# EAGLE design v1 (EAGLE 7.7.0)
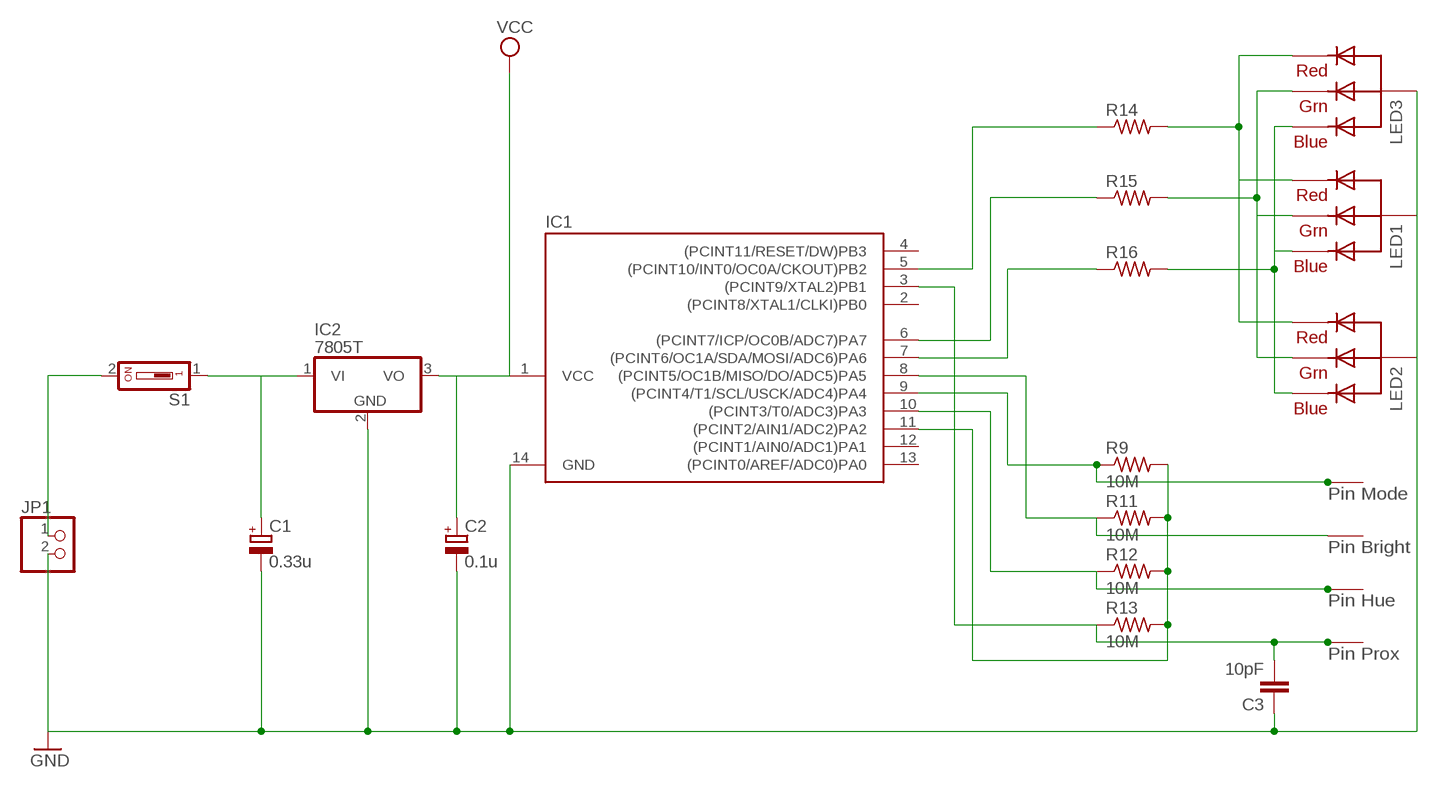
[diagram p0: schematic, sheet 1]

## Parts
2  TOUCH  [RENG]
C1  0.33u  CPOL-EUE2.5-6  [E2,5-6]
C2  0.1u  CPOL-EUE2.5-6  [E2,5-6]
C3  10pF  0.1UF-KIT-EZ-50V-20%  [CAP-PTH-SMALL-KIT]
IC1  TINY24/44/84-PU  [DIL14]
IC2  7805T  [TO220H]
JP1  PINHD-1X2/90  [1X02/90]
LED1  RGBLED_CA-5MM  [LED5MMRGB]
LED2  RGBLED_CA-5MM  [LED5MMRGB]
LED3  RGBLED_CA-5MM  [LED5MMRGB]
PIN_PROX  TOUCH  [RENG]
PROX_PIN  TOUCH  [RENG]
R9  10M  R-US_0207/10  [0207/10]
R11  10M  R-US_0207/10  [0207/10]
R12  10M  R-US_0207/10  [0207/10]
R13  10M  R-US_0207/10  [0207/10]
R14  R-US_0207/10  [0207/10]
R15  R-US_0207/10  [0207/10]
R16  R-US_0207/10  [0207/10]
S1  SD4-01  [SD4-01]
U$3  TOUCH  [RENG]

## Nets
B: LED1.4(BLUE) LED2.4(BLUE) LED3.4(BLUE) R16.2
B1: IC1.7((PCINT6/OC1A/SDA/MOSI/ADC6)PA6) R16.1
BASE: IC1.11((PCINT2/AIN1/ADC2)PA2) R9.2 R11.2 R12.2 R13.2
G: LED1.3(GREEN) LED2.3(GREEN) LED3.3(GREEN) R15.2
G1: IC1.6((PCINT7/ICP/OC0B/ADC7)PA7) R15.1
GND: C1.- C2.- C3.1 IC1.14(GND) IC2.2(GND) JP1.2 LED1.2(VCC) LED2.2(VCC) LED3.2(VCC)
N$2: JP1.1 S1.2
N$5: C1.+ IC2.1(VI) S1.1
PIN0: 2.T IC1.8((PCINT5/OC1B/MISO/DO/ADC5)PA5) R11.1
PIN1: IC1.9((PCINT4/T1/SCL/USCK/ADC4)PA4) PIN_PROX.T R9.1
PIN2: IC1.10((PCINT3/T0/ADC3)PA3) R12.1 U$3.T
PIN3: C3.2 IC1.3((PCINT9/XTAL2)PB1) PROX_PIN.T R13.1
R: LED1.1(RED) LED2.1(RED) LED3.1(RED) R14.2
R1: IC1.5((PCINT10/INT0/OC0A/CKOUT)PB2) R14.1
VCC: C2.+ IC1.1(VCC) IC2.3(VO)
Unconnected: IC1.2((PCINT8/XTAL1/CLKI)PB0) IC1.4((PCINT11/RESET/DW)PB3) IC1.12((PCINT1/AIN0/ADC1)PA1) IC1.13((PCINT0/AREF/ADC0)PA0)

## Notes on the sheet
- Pin Mode
- Pin Bright
- Pin Hue
- Pin Prox

## Library data of the parts
2 PIN_PROX PROX_PIN U$3 = madebyreng:TOUCH
C1 C2 = rcl:CPOL-EU: POLARIZED CAPACITOR, European symbol
C3 = SparkFun-Capacitors:0.1UF: 0.1µF ceramic capacitors A capacitor is a passive two-terminal electrical component used to store electrical energy temporarily in an electric field.; PROD_ID: CAP-08370; VALUE: 0.1uF
IC1 = atmega-atxmega:TINY24/44/84: • High Performance, Low Power AVR® 8-bit Microcontroller • Advanced RISC Architecture – 120 Powerful Instructions – Most Single Clock Cycle Execution – 32 x 8 General Purpose Working Registers – Fully Static Operation • High Endurance, Non-volatile Memory Segments – 2K/4K/8K Bytes of In-System, Self-programmable Flash Program Memory • Endurance: 10,000 Write/Erase Cycles – 128/256/512 Bytes of In-System Programmable EEPROM • Endurance: 100,000 Write/Erase Cycles – 128/256/512 Bytes of Internal SRAM – Data Retention: 20 years at 85°C / 100 years at 25°C – Programming Lock for Self-programming Flash & EEPROM Data Security • Peripheral Features – One 8-bit and One 16-bit Timer/Counter with Two PWM Channels, Each – 10-bit ADC • 8 Single-ended Channels • 12 Differential ADC Channel Pairs with Programmable Gain (1x / 20x) – Programmable Watchdog Timer with Separate On-chip Oscillator – On-chip Analog Comparator – Universal Serial Interface • Special Microcontroller Features – debugWIRE On-chip Debug System – In-System Programmable via SPI Port – Internal and External Interrupt Sources • Pin Change Interrupt on 12 Pins – Low Power Idle, ADC Noise Reduction, Standby and Power-down Modes – Enhanced Power-on Reset Circuit – Programmable Brown-out Detection Circuit with Software Disable Function – Internal Calibrated Oscillator – On-chip Temperature Sensor • I/O and Packages – Available in 20-pin QFN/MLF/VQFN, 14-pin SOIC, 14-pin PDIP and 15-ball UFBGA – Twelve Programmable I/O Lines • Operating Voltage: – 1.8 – 5.5V • Speed Grade: – 0 – 4 MHz @ 1.8 – 5.5V – 0 – 10 MHz @ 2.7 – 5.5V – 0 – 20 MHz @ 4.5 – 5.5V • Industrial Temperature Range: -40°C to +85°C • Low Power Consumption – Active Mode: • 210 μA at 1.8V and 1 MHz – Idle Mode: • 33 μA at 1.8V and 1 MHz – Power-down Mode: • 0.1 μA at 1.8V and 25°C
IC2 = linear:78*: Positive VOLTAGE REGULATOR Source: http://cache.national.com/ds/LM/LM78L05.pdf http://www.fairchildsemi.com/ds/LM/LM7805.pdf
JP1 = pinhead:PINHD-1X2: PIN HEADER
LED1-LED3 = adafruit:RGBLED_CA: RGB LED, common-anode 5MM Staggered pins 5mm Piranha package http://www.ladyada.net/library/pcb/eaglelibrary.html
R9 R11-R16 = rcl:R-US_: RESISTOR, American symbol
S1 = switch-dil:SD4-01: DIL/CODE SWITCH; OC_FARNELL: unknown; OC_NEWARK: unknown

## Board
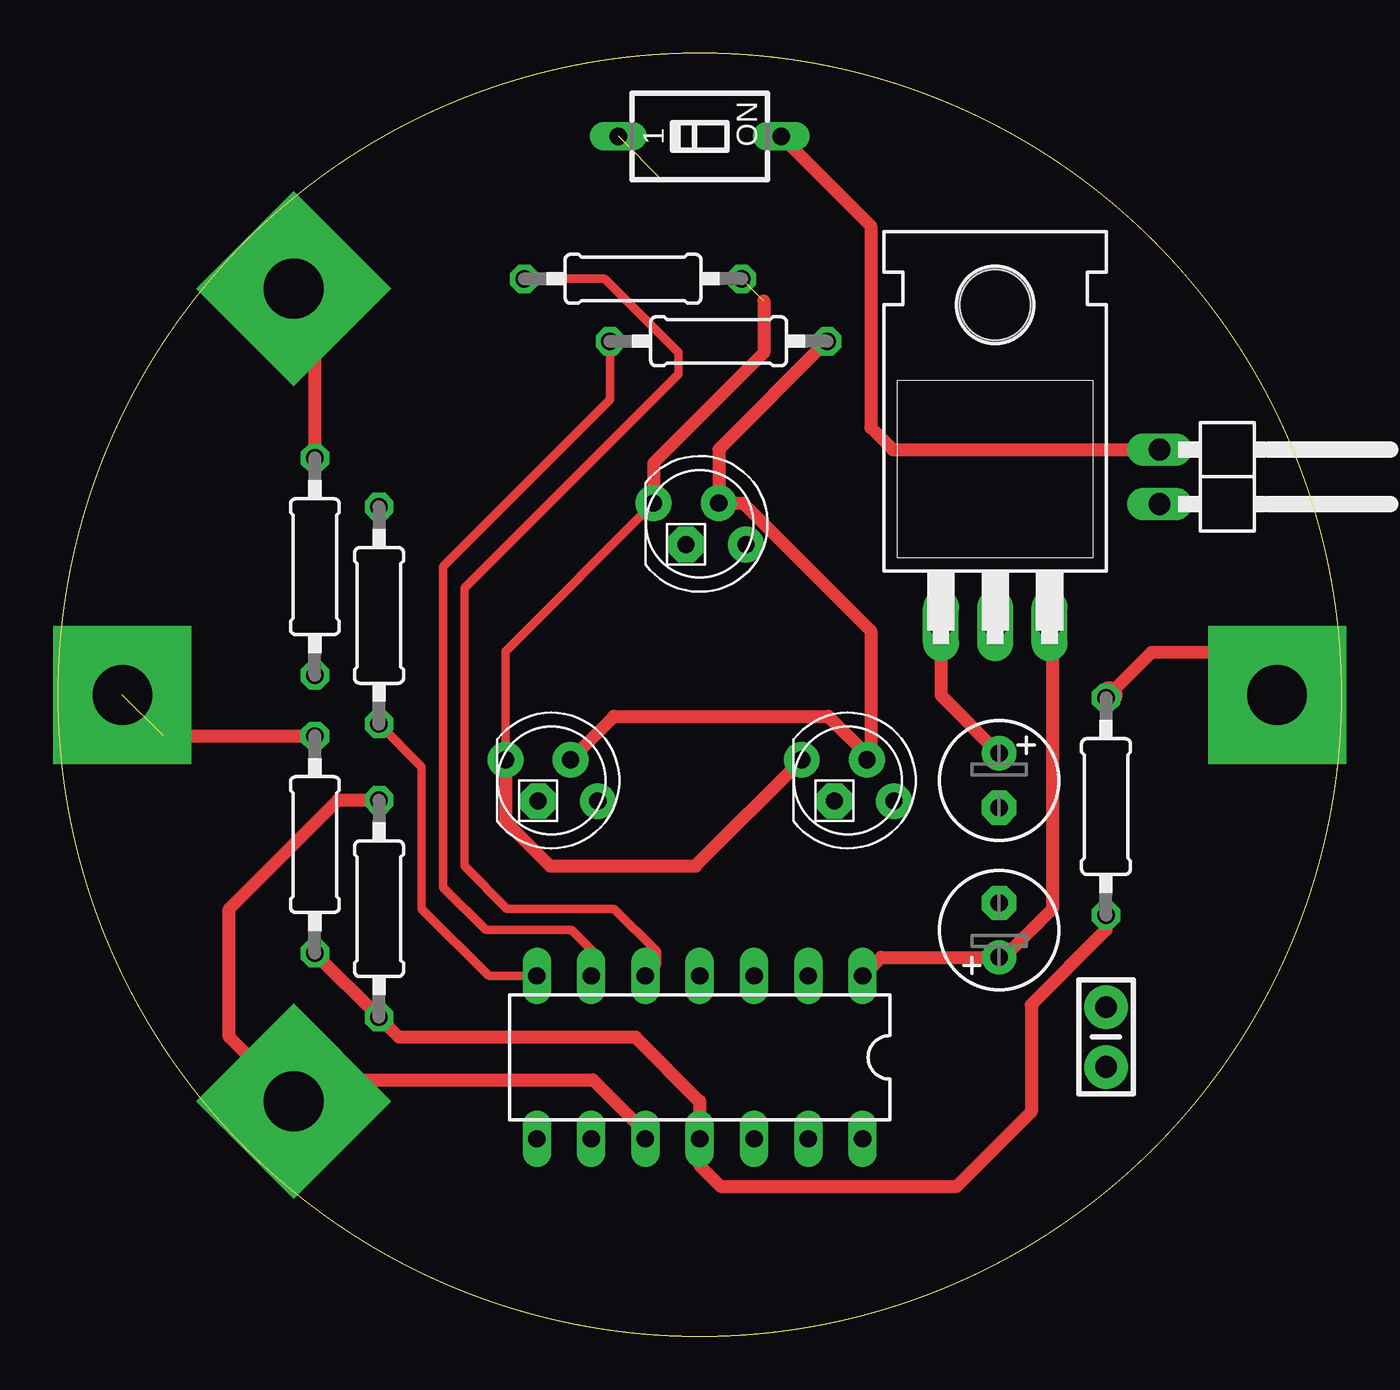
[diagram p1: board, top side]
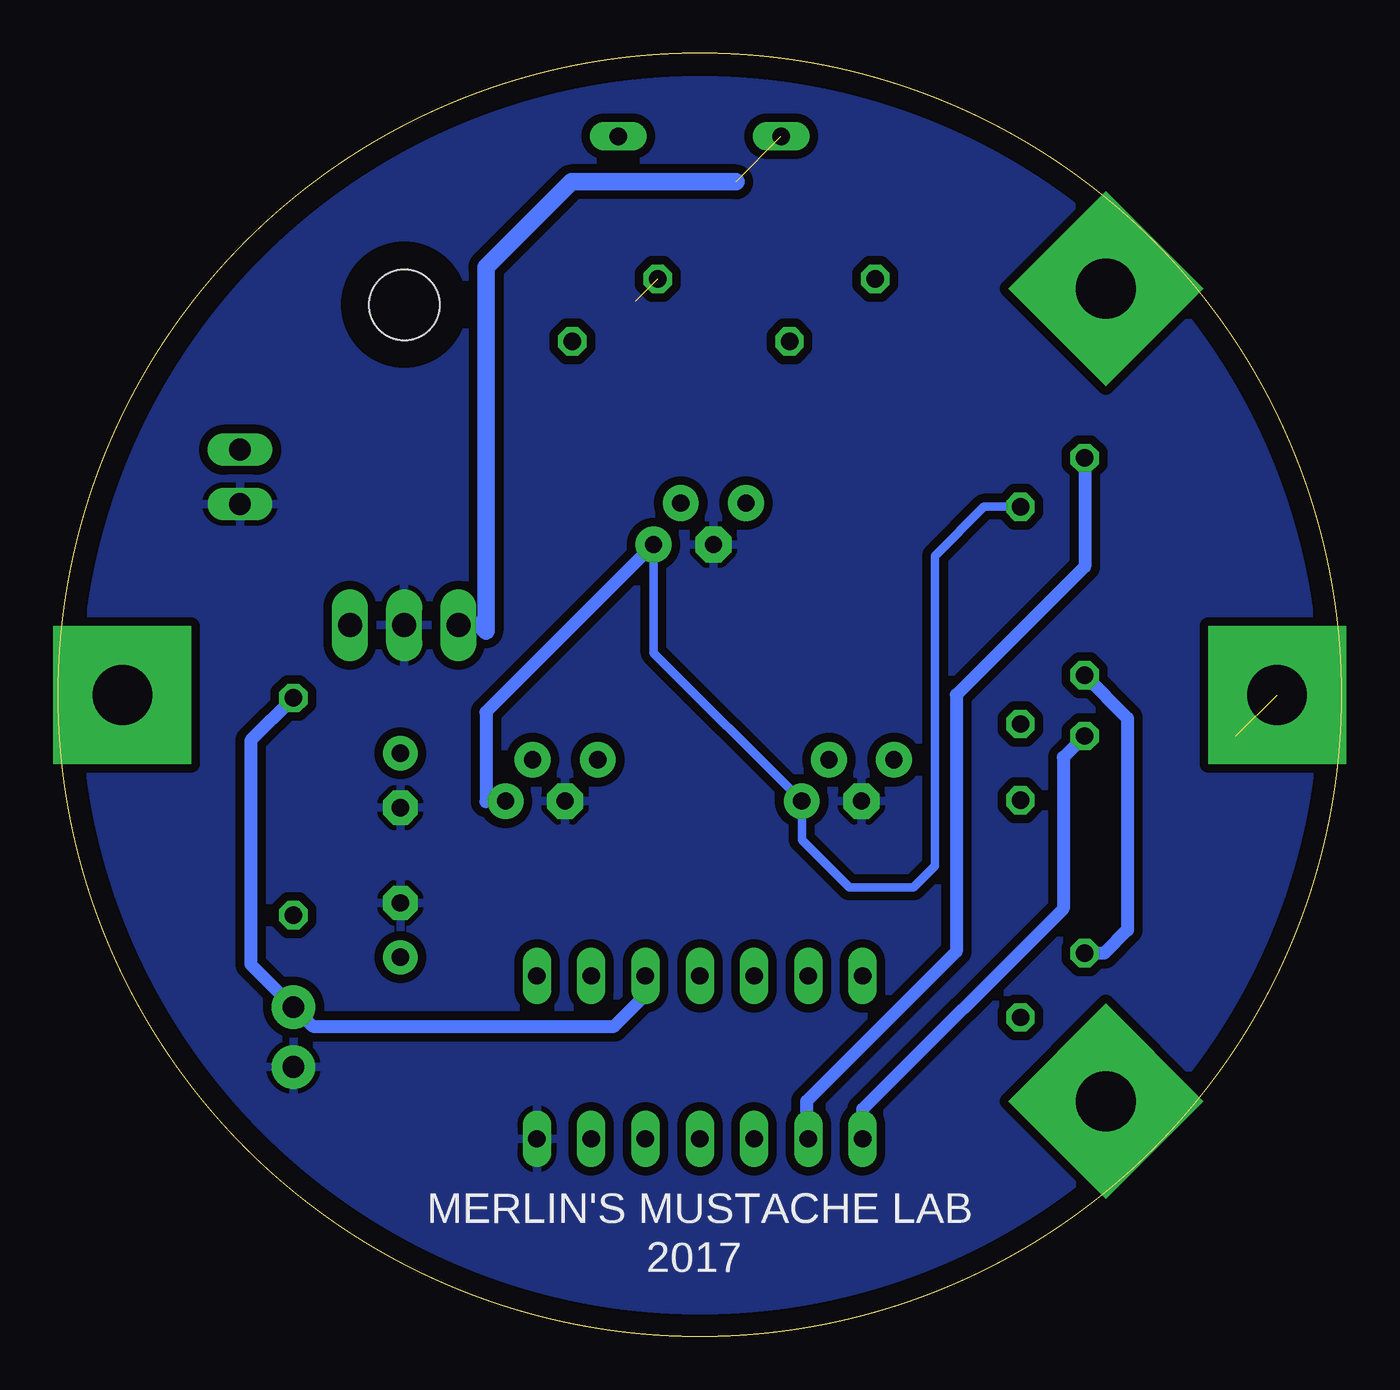
[diagram p2: board, bottom side, seen from below]

Size 60 x 60 mm. Coordinates in mm from the lower left corner, seen from the top.
Outline: circle at 30,30 radius 30
Copper layers (1*16): Top 0.035mm / dielectric 1.5mm / Bottom 0.035mm
Design rules "default": minimum track width 10mil, minimum drill 24mil, track to track 8mil, track to pad 8mil, pad to pad 8mil, via to via 8mil, smd to smd 8mil, copper to edge 40mil, drill to drill 8mil, minimum pad ring 10mil, minimum via ring 8mil, stop-mask expansion 4mil, vias tented up to drill 0mil, thermal gap 10mil

### Footprints (pad centres in the part's own frame; a part is rotated, then mirrored left to right if it is on the bottom)
RENG = drill 2.8 pad 6.452 square: T 0,0
E2,5-6 = drill 0.813 pad 1.6: + -1.27,0 | drill 0.813 pad 1.6 octagon: - 1.27,0
CAP-PTH-SMALL-KIT = drill 1.016 pad 2.032: 1 -1.397,0; 2 1.397,0
DIL14 = drill 0.813 long: 1 -7.62,-3.81; 2 -5.08,-3.81; 3 -2.54,-3.81; 4 0,-3.81; 5 2.54,-3.81; 6 5.08,-3.81; 7 7.62,-3.81; 8 7.62,3.81; 9 5.08,3.81; 10 2.54,3.81; 11 0,3.81; 12 -2.54,3.81; 13 -5.08,3.81; 14 -7.62,3.81
TO220H = drill 1.118 long: 1 -2.54,-10.16; 2 0,-10.16; 3 2.54,-10.16 | hole 3.302: 0,4.826
1X02/90 = drill 1.016 long: 1 -1.27,-3.81; 2 1.27,-3.81
LED5MMRGB = drill 0.8 pad 1.676: 1 -2.159,0.968; 3 0.889,0.968; 4 2.159,-0.968 | drill 0.8 pad 1.676 octagon: 2 -0.635,-0.968
0207/10 = drill 0.813 octagon: 1 -5.08,0; 2 5.08,0
SD4-01 = drill 0.813 long: 1 0,-3.81; 2 0,3.81

### Placement (x,y rotation side)
2  3,30 0 top
C1  44,26 270 top
C2  44,19 90 top
C3  49,14 90 top
IC1  30,13.05 180 top
IC2  43.82,43.42 0 top
JP1  55.31,40.2 270 top
LED1  23.07,26 0 top
LED2  30,38 0 top
LED3  36.93,26 0 top
PIN_PROX  11,49 45 top
PROX_PIN  57,30 0 top
R9  12,36 270 top
R11  12,23 270 top
R12  15,20 270 top
R13  49,24.78 270 top
R14  26.88,49.46 0 top
R15  30.88,46.54 0 top
R16  15,33.72 90 top
S1  30,56.12 270 top
U$3  11,11 45 top

### Tracks (layer width: path | path; a pad name or v marks a point on that pad's centre or on a via)
B
  Bottom 0.406: LED2.4 32.16,31.96 LED1.4 25.23,23.23 23,21 20,21 19,22 19,36.5 16.7,38.8 R16.2
  Bottom 0.61: LED2.4 40,29.19 40,25 39.97,25.03 LED3.4
B1
  Top 0.406: R16.1 17,26.64 17,20 20.14,16.86 IC1.7
BASE
  Top 0.61: R11.2 R12.2 15.92,14 27,14 30,11 IC1.11 30,8 31,7 42,7 45.5,10.5 45.5,15.5 49,19 R13.2
  Bottom 0.61: R9.2 10,28.92 10,19 11.08,17.92 R11.2
G
  Top 0.61: LED1.3 25.99,29 36,29 37.82,27.18 LED3.3 38,27.15 38,33 32.03,38.97 LED2.3 30.89,41.47 R15.2
G1
  Top 0.406: R15.1 25.8,43.8 18,36 18,21 20,19 24,19 25,18 25,16.94 IC1.6
GND
  pour Bottom (isolate 0.406): 0,30 arc90 29,0 arc90 60,30 arc90 30,60 arc90
N$2
  Top 0.61: S1.2 38,51.93 38,42.5 39.03,41.47 JP1.1
N$5  (1 unrouted)
  Top 0.61: IC2.1 41.28,29.99 C1.+
  Bottom 0.813: 28.31,54 36,54 40,50 40,33 40.26,33.26 IC2.1
PIN0  (1 unrouted)
  Top 0.61: 4.92,28.08 R11.1
  Bottom 0.61: R11.1 13,27.08 13,20 22.38,10.62 IC1.8
PIN1
  Top 0.61: PIN_PROX.T 12,48 R9.1
  Bottom 0.61: R9.1 12,36 18,30 18,18 25,11 25,9.32 IC1.9
PIN2
  Top 0.61: R12.1 13.08,25.08 8,20 8,14 U$3.T 12,12 25,12 27.46,9.54 IC1.10
PIN3
  Top 0.61: 49.14,30 51.14,32 56.5,32 57,31.5 PROX_PIN.T
  Top 1.27: R13.1 49.14,30
  Bottom 0.61: R13.1 51,27.86 51,17.4 C3.2 48.1,14.5 34,14.5 32.54,15.96 IC1.3
R  (1 unrouted)
  Top 0.406: LED1.1 20.91,32.04 LED2.1
  Top 0.61: 33,48.42 33,46 27.84,40.84 LED2.1 | LED1.1 20.91,24.09 23,22 29.8,22 LED3.1
R1
  Top 0.406: R14.1 25.54,49.46 29,46 29,45 19,35 19,22 21,20 26,20 28,18 28,17.4 IC1.5
VCC
  Top 0.61: IC2.3 46.5,33.12 46.5,20 44.23,17.73 C2.+ 38.49,17.73 IC1.1

### Text on the board
bNames: MERLIN'S MUSTACHE LAB | 2017